# Altium schematic sheet [12]-CAMERA_POWER.SchDoc
size A4
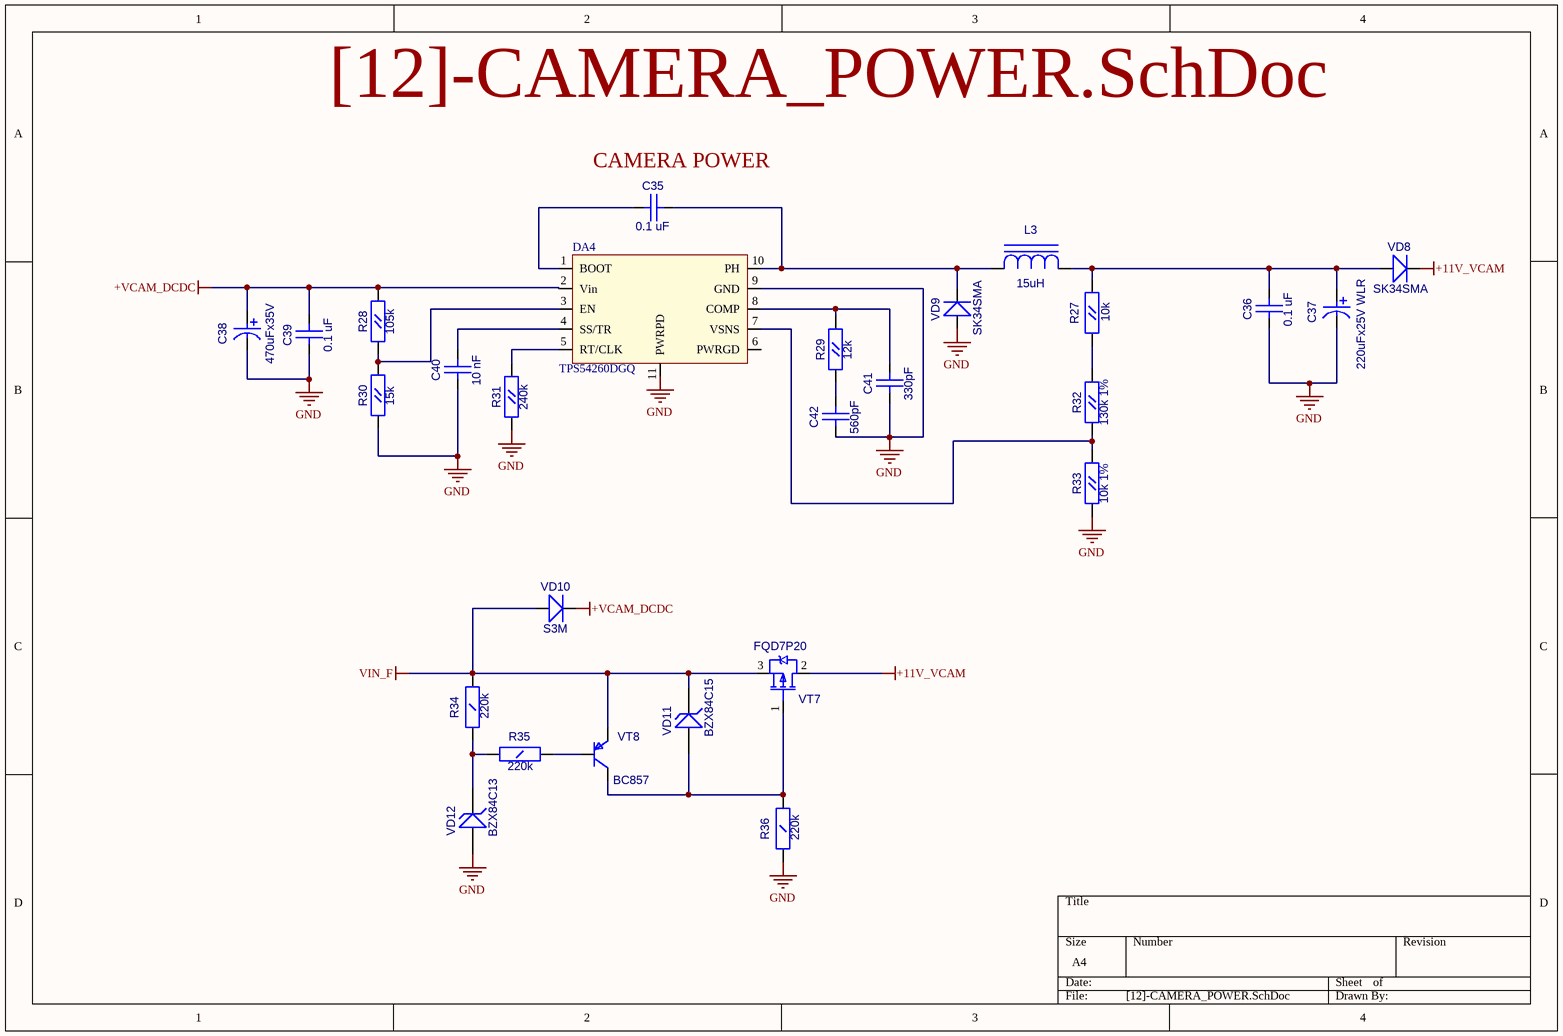
[diagram p0: [12]-CAMERA_POWER.SchDoc]

## Parts
C35  0.1 uF  [CC0603]
C36  0.1 uF  [CC0603]
C37  220uFx25V WLR  [CC8X3.5]
C38  470uFx35V  [CC16X10_CAP0.5(1)(Primary)]
C39  0.1 uF  [CC0603]
C40  10 nF  [CC0603]
C41  330pF  [CC0603]
C42  560pF  [CC0603]
DA4  TPS54260DGQ  [S-PDSO-G10]
L3  15uH  [SDR0805]
R27  10k  [RC0603]
R28  105k  [RC0603]
R29  12k  [RC0603]
R30  15k  [RC0603]
R31  240k  [RC0603]
R32  130k 1%  [RC0603]
R33  10k 1%  [RC0603]
R34  220k  [RC1206]
R35  220k  [RC1206]
R36  220k  [RC1206]
VD8  SK34SMA  [SMA]
VD9  SK34SMA  [SMA]
VD10  S3M  [SMC]
VD11  BZX84C15  [SOT-23(123)]
VD12  BZX84C13  [SOT-23(123)]
VT7  FQD7P20  [D-PAK(TO-252AA)]
VT8  BC857  [SOT-23(123)]

## Nets
+11V_VCAM: VD8.2(K) VT7.2(D)
+VCAM_DCDC: C38.2 C39.1(A) DA4.2(Vin) R28.2(B) VD10.2(K)
GND: C36.2(B) C37.2 C38.1 C39.2(B) C40.2(B) C41.2(B) C42.2(B) DA4.9(GND) DA4.11(PWRPD) R30.1(A) R31.1(A) R33.1(A) R36.1(A) VD9.1(A) VD12.1(A)
VIN_F: R34.2(B) VD10.1(A) VD11.3(K) VT7.3(S) VT8.2(E)
NetC35_1: C35.1(A) DA4.10(PH) L3.1(C) VD9.2(K)
NetC35_2: C35.2(B) DA4.1(BOOT)
NetC36_1: C36.1(A) C37.1 L3.2(A) R27.2(B) VD8.1(A)
NetC40_1: C40.1(A) DA4.4(SS/TR)
NetC41_1: C41.1(A) DA4.8(COMP) R29.2(B)
NetC42_1: C42.1(A) R29.1(A)
NetDA4_3: DA4.3(EN) R28.1(A) R30.2(B)
NetDA4_5: DA4.5(RT/CLK) R31.2(B)
NetDA4_7: DA4.7(VSNS) R32.1(A) R33.2(B)
NetR27_1: R27.1(A) R32.2(B)
NetR34_1: R34.1(A) R35.1(A) VD12.3(K)
NetR35_2: R35.2(B) VT8.1(B)
NetR36_2: R36.2(B) VD11.1(A) VT7.1(G) VT8.3(C)

Not connected (* = marked no-connect by the designer): DA4 6(PWRGD)

## Notes on the sheet
- (near C35) CAMERA POWER

## Library data of the parts
C35 C36 C39-C42 = CC0603
  C35 C36 C39: Value: 0.1 uF
  C40: Value: 10 nF
  C41: Value: 330pF
  C42: Value: 560pF
C37 = CAP0.35: Value: 220uFx25V WLR
C38 = CAP0.5(1): Value: 470uFx35V
L3 = SDR0805: Value: 15uH
R27-R33 = RC0603
  R27: Value: 10k
  R28: Value: 105k
  R29: Value: 12k
  R30: Value: 15k
  R31: Value: 240k
  R32: Value: 130k 1%
  R33: Value: 10k 1%
R34-R36 = RC1206: Value: 220k
VD8 VD9 = SK34SMA: Schottky Rectifier; Value: {Value}
VD10 = S3A: Schottky Rectifier; Value: S3M
VD11 VD12 = BZX84: Zener Voltage Regulator Diode
  VD11: Value: BZX84C15
  VD12: Value: BZX84C13
VT7 = IRFR9220: HEXFET Power MOSFET; OriginalName: IRLML5103; ComponentField7: Published 8-Jun-2000; Value: FQD7P20
VT8 = BC857B: PNP 100ma transistor; OriginalName: BC846BLT1; ComponentField7: Published 29-Sep-2000; Value: BC857